# EAGLE design emonTx2.5 (EAGLE 6.5.0)
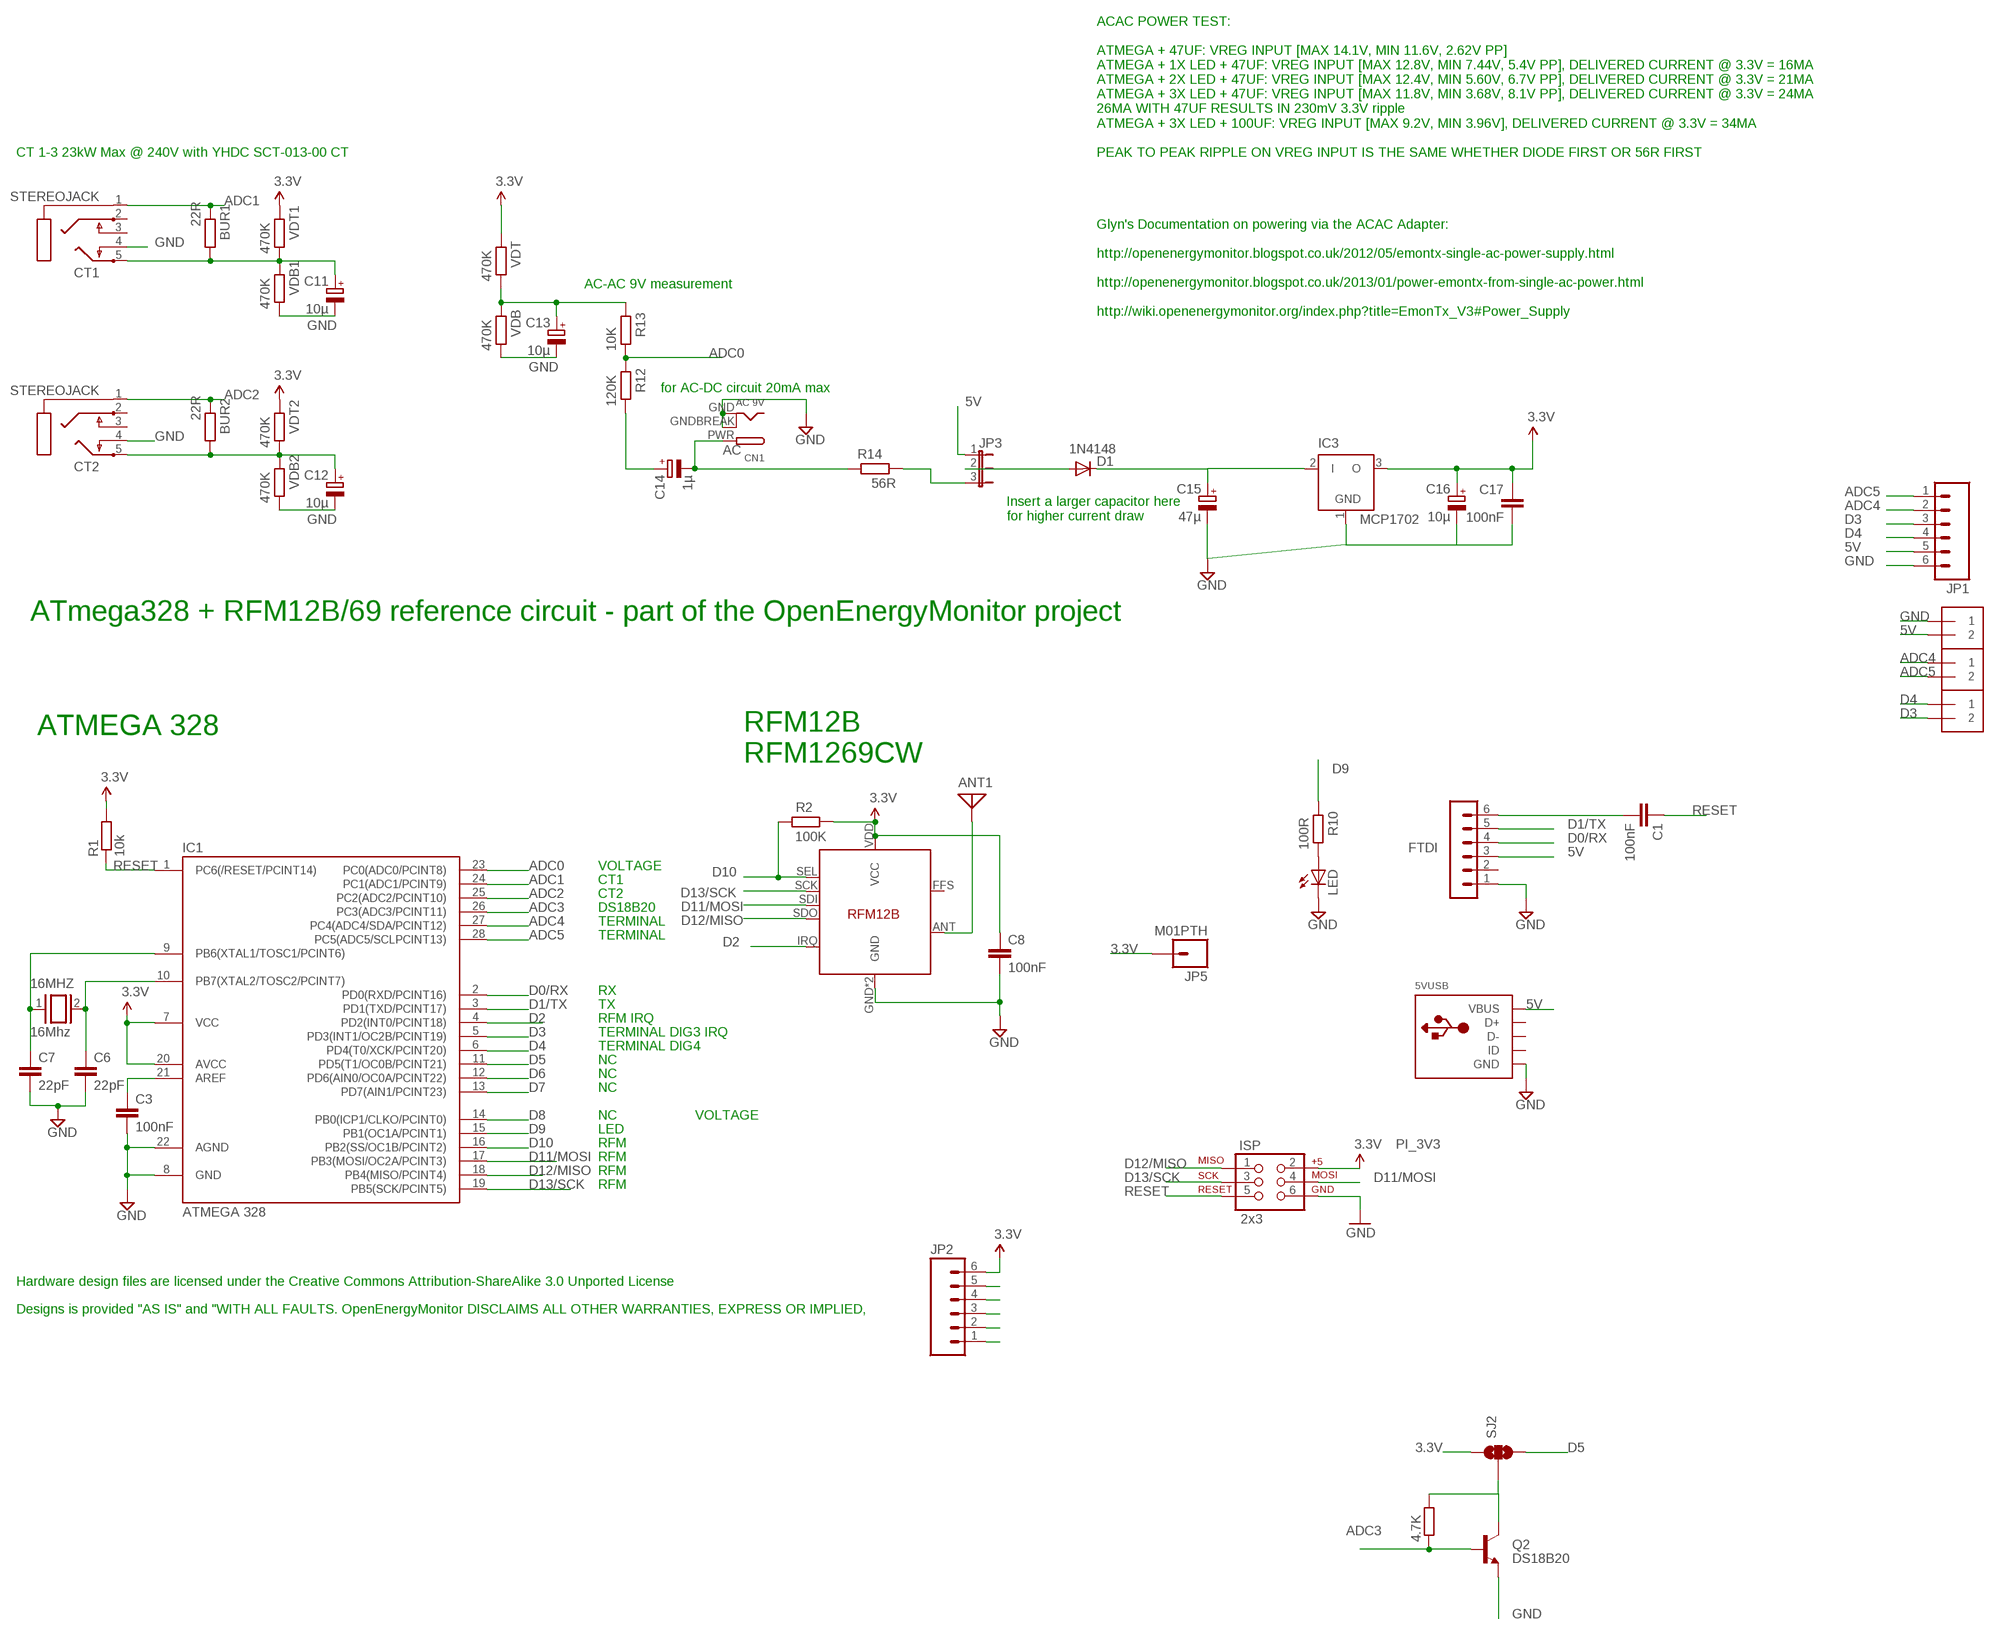
[diagram p0: schematic, sheet 1]

## Parts
5VUSB  USBMOLEX  [USB-MINIB-THM-MOLEX]
16MHZ  16Mhz  XTAL/S  [QS]
ANT1  ANTENNA  [PAD-01]
BUR1  22R  R-EU_0204/7  [0204/7]
BUR2  22R  R-EU_0204/7  [0204/7]
C1  100nF  C-EU025-024X044  [C025-024X044]
C3  100nF  C-EU025-024X044  [C025-024X044]
C6  22pF  C2.5/2  [C2.5-2]
C7  22pF  C2.5/2  [C2.5-2]
C8  100nF  C-EU025-024X044  [C025-024X044]
C11  10µ  CPOL-EUE1.8-4  [E1,8-4]
C12  10µ  CPOL-EUE1.8-4  [E1,8-4]
C13  10µ  CPOL-EUE1.8-4  [E1,8-4]
C14  1µ  CPOL-EUE1.8-4  [E1,8-4]
C15  47µ  CPOL-EUE1.8-4  [E1,8-4]
C16  10µ  CPOL-EUE1.8-4  [E1,8-4]
C17  100nF  C-EU025-024X044  [C025-024X044]
CN1  AC 9V  DCBARRELPTH  [DCJACK_2MM_PTH]
CT1  STEREOJACK  [STX3100]
CT2  STEREOJACK  [STX3100]
D1  1N4148  DIODE1N4148  [DIODE-1N4148]
FTDI  FTDI  MA06-1  [MA06-1]
IC1  ATMEGA 328  ATMEGA48/88/168-PU  [DIL28-3]
IC3  MCP1702  MCP1702Z  [TO92]
ISP  2x3  AVR_SPI_PRG_6PTH  [2X3]
J1  1X2-3.5MM  [1X2-3.5MM]
J2  1X2-3.5MM  [1X2-3.5MM]
J3  1X2-3.5MM  [1X2-3.5MM]
JP1  M06SIP  [1X06]
JP2  M06SIP  [1X06]
JP3  JP2E  [JP2]
JP5  M01PTH  [1X01]
LED  LED3MM  [LED3MM]
Q2  DS18B20  TRANSISTOR_NPNTO92  [TO-92]
R1  10k  R-EU_0204/7  [0204/7]
R2  100K  R-EU_0204/7  [0204/7]
R9  4.7K  R-EU_0204/7  [0204/7]
R10  100R  R-EU_0204/7  [0204/7]
R12  120K  R-EU_0204/7  [0204/7]
R13  10K  R-EU_0204/7  [0204/7]
R14  56R  R-EU_0204/7  [0204/7]
SJ2  SOLDERJUMPER_2WAY-OLDS  [SJ_3]
U$14  RFM12B  [RFM12B]
VDB  470K  R-EU_0204/7  [0204/7]
VDB1  470K  R-EU_0204/7  [0204/7]
VDB2  470K  R-EU_0204/7  [0204/7]
VDT  470K  R-EU_0204/7  [0204/7]
VDT1  470K  R-EU_0204/7  [0204/7]
VDT2  470K  R-EU_0204/7  [0204/7]

## Nets
3.3V: C8.1 C16.+ C17.1 IC1.7(VCC) IC1.20(AVCC) IC3.3(O) ISP.2 JP2.6 JP5.1 R1.2 R2.1 SJ2.1 U$14.VDD(VCC) VDT1.2 VDT2.2 VDT.2
5V [power]: 5VUSB.VBUS FTDI.3 J3.2 JP1.5 JP3.1
AC: C14.- CN1.PWR R14.2
ADC0: IC1.23(PC0(ADC0/PCINT8)) R12.2 R13.1
ADC1: BUR1.2 CT1.1 IC1.24(PC1(ADC1/PCINT9))
ADC2: BUR2.2 CT2.1 IC1.25(PC2(ADC2/PCINT10))
ADC3: IC1.26(PC3(ADC3/PCINT11)) Q2.2(B) R9.2
ADC4: IC1.27(PC4(ADC4/SDA/PCINT12)) J1.1 JP1.2
ADC5: IC1.28(PC5(ADC5/SCLPCINT13)) J1.2 JP1.1
D0/RX: FTDI.4 IC1.2(PD0(RXD/PCINT16))
D1/TX: FTDI.5 IC1.3(PD1(TXD/PCINT17))
D2: IC1.4(PD2(INT0/PCINT18)) U$14.IRQ
D3: IC1.5(PD3(INT1/OC2B/PCINT19)) J2.2 JP1.3
D4: IC1.6(PD4(T0/XCK/PCINT20)) J2.1 JP1.4
D5: IC1.11(PD5(T1/OC0B/PCINT21)) JP2.2 SJ2.3
D6: IC1.12(PD6(AIN0/OC0A/PCINT22)) JP2.3
D7: IC1.13(PD7(AIN1/PCINT23)) JP2.4
D8: IC1.14(PB0(ICP1/CLKO/PCINT0)) JP2.5
D9: IC1.15(PB1(OC1A/PCINT1)) R10.2
D10: IC1.16(PB2(SS/OC1B/PCINT2)) R2.2 U$14.SEL
D11/MOSI: IC1.17(PB3(MOSI/OC2A/PCINT3)) ISP.4 U$14.SDI
D12/MISO: IC1.18(PB4(MISO/PCINT4)) ISP.1 U$14.SDO
D13/SCK: IC1.19(PB5(SCK/PCINT5)) ISP.3 U$14.SCK
DIG1: ANT1.1 U$14.ANT
GND [power]: 5VUSB.GND C3.2 C6.2 C7.2 C8.2 C11.- C12.- C13.- C15.- C16.- C17.2 CN1.GND CN1.GNDBREAK CT1.4 CT2.4 FTDI.1 IC1.8(GND) IC1.22(AGND) IC3.1(GND) ISP.6 J3.1 JP1.6 JP2.1 LED.K(C) Q2.1(E) U$14.GND U$14.P$12(GND) VDB1.1 VDB2.1 VDB.1
N$1: 16MHZ.2 C6.1 IC1.10(PB7(XTAL2/TOSC2/PCINT7))
N$2: BUR2.1 C12.+ CT2.5 VDB2.2 VDT2.1
N$3: JP3.3 R14.1
N$4: C15.+ D1.C IC3.2(I)
N$5: D1.A JP3.2
N$7: C14.+ R12.1
N$8: LED.A R10.1
N$9: Q2.3(C) R9.1 SJ2.2
N$12: 16MHZ.1 C7.1 IC1.9(PB6(XTAL1/TOSC1/PCINT6))
N$15: C1.2 FTDI.6
N$19: C3.1 IC1.21(AREF)
N$34: C13.+ R13.2 VDB.2 VDT.1
N$38: BUR1.1 C11.+ CT1.5 VDB1.2 VDT1.1
RESET: C1.1 IC1.1(PC6(/RESET/PCINT14)) ISP.5 R1.1
Unconnected: 5VUSB.D+ 5VUSB.D- 5VUSB.ID CT1.2 CT1.3 CT2.2 CT2.3 FTDI.2 U$14.FFS

## Notes on the sheet
- CT 1-3 23kW Max @ 240V with YHDC SCT-013-00 CT
- ACAC POWER TEST:
  
  ATMEGA + 47UF: VREG INPUT [MAX 14.1V, MIN 11.6V, 2.62V PP]
  ATMEGA + 1X LED + 47UF: VREG INPUT [MAX 12.8V, MIN 7.44V, 5.4V PP], DELIVERED CURRENT @ 3.3V = 16MA
  ATMEGA + 2X LED + 47UF: VREG INPUT [MAX 12.4V, MIN 5.60V, 6.7V PP], DELIVERED CURRENT @ 3.3V = 21MA
  ATMEGA + 3X LED + 47UF: VREG INPUT [MAX 11.8V, MIN 3.68V, 8.1V PP], DELIVERED CURRENT @ 3.3V = 24MA
  26MA WITH 47UF RESULTS IN 230mV 3.3V ripple
  ATMEGA + 3X LED + 100UF: VREG INPUT [MAX 9.2V, MIN 3.96V], DELIVERED CURRENT @ 3.3V = 34MA
  
  PEAK TO PEAK RIPPLE ON VREG INPUT IS THE SAME WHETHER DIODE FIRST OR 56R FIRST
- AC-AC 9V measurement
- Glyn's Documentation on powering via the ACAC Adapter:
  
  http://openenergymonitor.blogspot.co.uk/2012/05/emontx-single-ac-power-supply.html
  
  http://openenergymonitor.blogspot.co.uk/2013/01/power-emontx-from-single-ac-power.html
  
  http://wiki.openenergymonitor.org/index.php?title=EmonTx_V3#Power_Supply
- for AC-DC circuit 20mA max
- Insert a larger capacitor here
  for higher current draw
- ATmega328 + RFM12B/69 reference circuit - part of the OpenEnergyMonitor project
- ATMEGA 328
- RFM12B
  RFM1269CW
- VOLTAGE
- CT1
- CT2
- DS18B20
- TERMINAL
- TERMINAL
- RX
- TX
- RFM IRQ
- TERMINAL DIG3 IRQ
- TERMINAL DIG4
- NC
- NC
- NC
- NC | VOLTAGE
- LED
- RFM
- RFM
- RFM
- RFM
- Hardware design files are licensed under the Creative Commons Attribution-ShareAlike 3.0 Unported License
- Designs is provided "AS IS" and "WITH ALL FAULTS. OpenEnergyMonitor DISCLAIMS ALL OTHER WARRANTIES, EXPRESS OR IMPLIED,

## Library data of the parts
5VUSB = adafruit:USB: USB Connectors USBMINIB - Surface Mount Female Mini-B USB Connector 4UConnector: 06564 By microbuilder.eu Thru-hole RA Female Mini-B USB Connector 4UConnector: 18732 By ladyada.net
16MHZ = special:XTAL/S: CRYSTAL
ANT1 = discrete:ANTENNA: Antenna
BUR1 BUR2 R2 R9 R10 R12-R14 VDB VDB1 VDB2 VDT VDT1 VDT2 = rcl:R-EU_: RESISTOR, European symbol
C1 C3 C8 C17 = resistor:C-EU: CAPACITOR, European symbol
C6 C7 = capacitor-wima:C: CAPACITOR naming: grid - package width
C11-C16 = resistor:CPOL-EU: POLARIZED CAPACITOR, European symbol
CN1 = adafruit:DCBARREL: 2.0mm DC Barrel Jack DCJACK_2MM_PTH - Through Hole Jack (4UConnector: 05537)
CT1 CT2 = adafruit:STEREOJACK: MIC/HEADPHONE JACK Stereo jack with two switches. Kycon STX3100, CUI SJ1-3555NG and/or 4UCon 05544
D1 = SparkFun:DIODE: Diode These are standard reverse protection diodes and small signal diodes. SMA package can handle up to about 1A. SOD-323 can handle about 200mA. What the SOD-323 package when ordering, there are some mfgs out there that are 5-pin packages.
FTDI = JeeLabs:MA06-1: PIN HEADER
IC1 = atmega8:ATMEGA48/88/168-PU
IC3 = JeeLabs:MCP1702: 200 mA, Low Power Low Dropout Voltage Regulator
ISP = SparkFun:AVR_SPI_PRG_6: AVR ISP 6 Pin This is the reduced ISP connector for AVR programming. Common on Arduino. This footprint will take up less PCB space and can be used with a 10-pin to 6-pin adapter such as SKU: BOB-08508
J1-J3 = adafruit:1X2: 3.5mm Terminal block http://www.ladyada.net/library/pcb/eaglelibrary.html
JP1 JP2 = SparkFun:M06: Header 6 Standard 6-pin 0.1" header. Use with straight break away headers (SKU : PRT-00116), right angle break away headers (PRT-00553), swiss pins (PRT-00743), machine pins (PRT-00117), and female headers (PRT-00115). Molex polarized connector foot print use with SKU : PRT-08094 with associated crimp pins and housings. NOTES ON THE VARIANTS LOCK and LOCK_LONGPADS... This footprint was designed to help hold the alignment of a through-hole component (i.e. 6-pin header) while soldering it into place. You may notice that each hole has been shifted either up or down by 0.005 of an inch from it's more standard position (which is a perfectly straight line). This slight alteration caused the pins (the squares in the middle) to touch the edges of the holes. Because they are alternating, it causes a "brace" to hold the component in place. 0.005 has proven to be the perfect amount of "off-center" position when using our standard breakaway headers. Although looks a little odd when you look at the bare footprint, once you have a header in there, the alteration is very hard to notice. Also, if you push a header all the way into place, it is covered up entirely on the bottom side. This idea of altering the position of holes to aid alignment will be further integrated into the Sparkfun Library for other footprints. It can help hold any component with 3 or more connection pins.
JP3 = jumper:JP2E: JUMPER
JP5 = SparkFun:M01: Header 1 Standard 1-pin 0.1" header. Use with straight break away headers (SKU : PRT-00116), right angle break away headers (PRT-00553), swiss pins (PRT-00743), machine pins (PRT-00117), and female headers (PRT-00115).
LED = adafruit:LED: LED OSRAM: - CHIPLED LG R971, LG N971, LY N971, LG Q971, LY Q971, LO R971, LY R971 LH N974, LH R974 LS Q976, LO Q976, LY Q976 LO Q996 - Hyper CHIPLED LW Q18S LB Q993, LB Q99A, LB R99A - SideLED LS A670, LO A670, LY A670, LG A670, LP A670 LB A673, LV A673, LT A673, LW A673 LH A674 LY A675 LS A676, LA A676, LO A676, LY A676, LW A676 LS A679, LY A679, LG A679 - Hyper Micro SIDELED® LS Y876, LA Y876, LO Y876, LY Y876 LT Y87S - SmartLED LW L88C, LW L88S LB L89C, LB L89S, LG L890 LS L89K, LO L89K, LY L89K LS L896, LA L896, LO L896, LY L896 - TOPLED LS T670, LO T670, LY T670, LG T670, LP T670 LSG T670, LSP T670, LSY T670, LOP T670, LYG T670 LG T671, LOG T671, LSG T671 LB T673, LV T673, LT T673, LW T673 LH T674 LS T676, LA T676, LO T676, LY T676, LB T676, LH T676, LSB T676, LW T676 LB T67C, LV T67C, LT T67C, LS T67K, LO T67K, LY T67K, LW E67C LS E67B, LA E67B, LO E67B, LY E67B, LB E67C, LV E67C, LT E67C LW T67C LS T679, LY T679, LG T679 LS T770, LO T770, LY T770, LG T770, LP T770 LB T773, LV T773, LT T773, LW T773 LH T774 LS E675, LA E675, LY E675, LS T675 LS T776, LA T776, LO T776, LY T776, LB T776 LHGB T686 LT T68C, LB T68C - Hyper Mini TOPLED® LB M676 - Mini TOPLED Santana® LG M470 LS M47K, LO M47K, LY M47K Source: http://www.osram.convergy.de/
Q2 = SparkFun:TRANSISTOR_NPN: Transistor NPN BJT configuration in SOT23 package. MMBT2222 is the common NPN we use. Double check BCE configuration again layout.
R1 = resistor:R-EU_: RESISTOR, European symbol
SJ2 = SparkFun:SOLDERJUMPER_2WAY-OLD: Solder Jumper 2 way solder jumper
U$14 = JeeParts:RFM12B

## Net classes
0 default: width 0.203 mm, drill 0.6 mm, clearance 0.203 mm
1 power: width 0.381 mm, drill 0.6 mm, clearance 0.254 mm
2 gnd: width 0.254 mm, drill 0.6 mm, clearance 0.254 mm

## Board
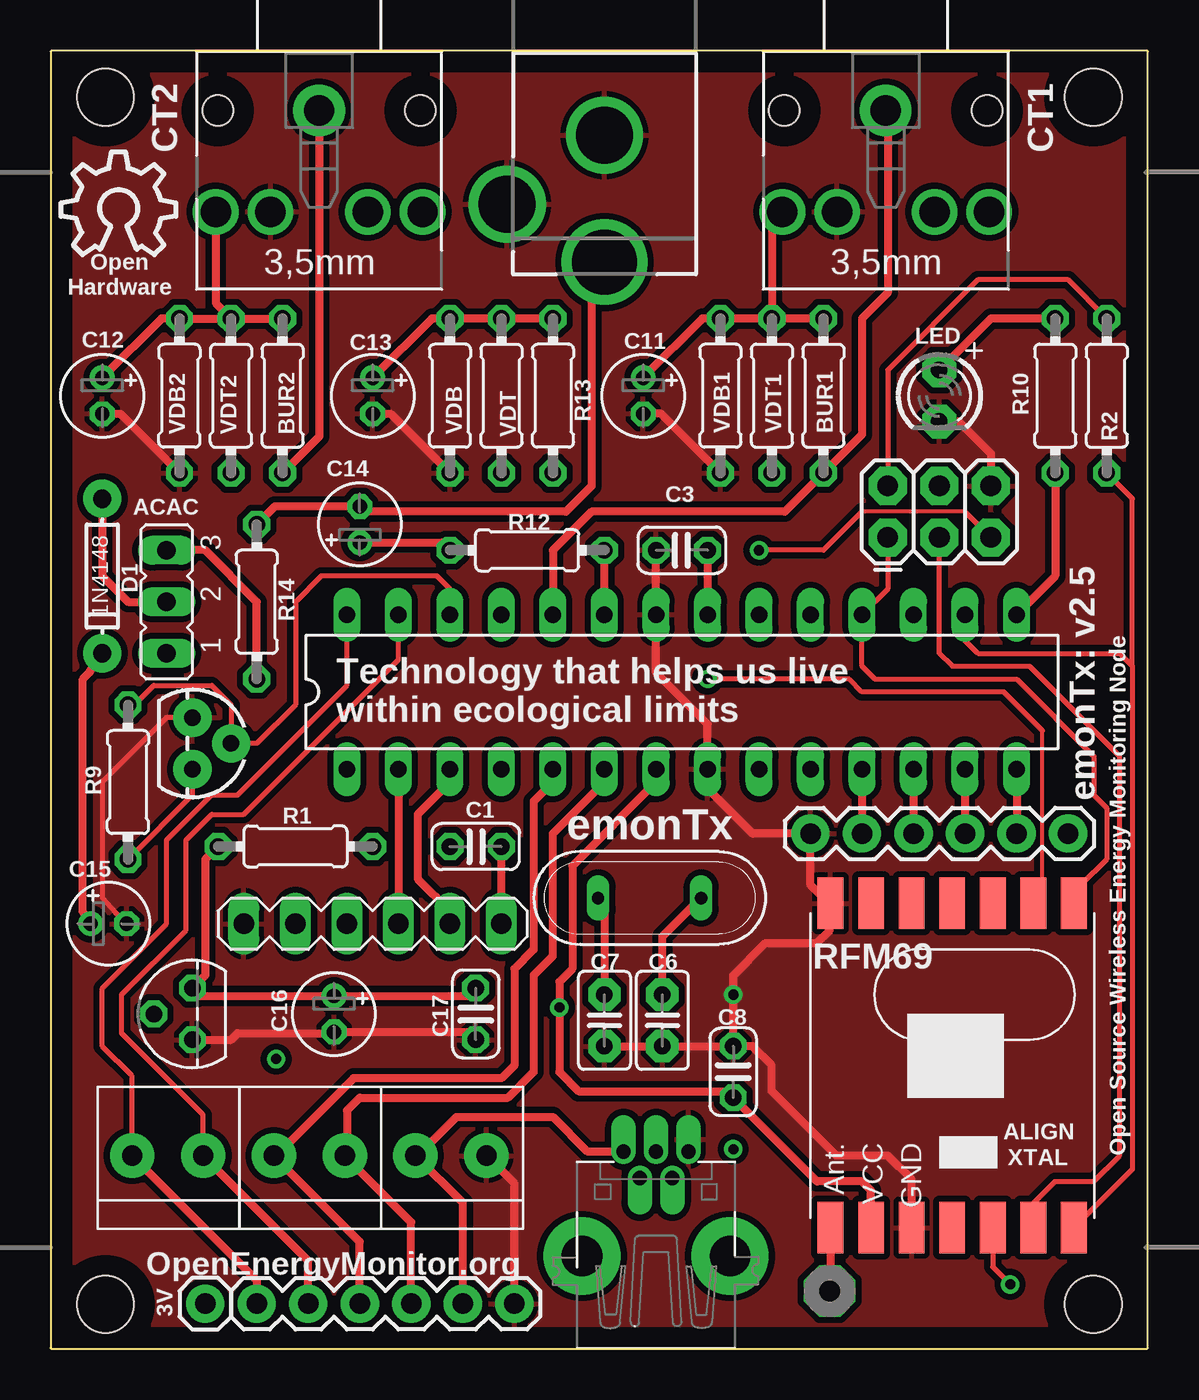
[diagram p1: board, top side]
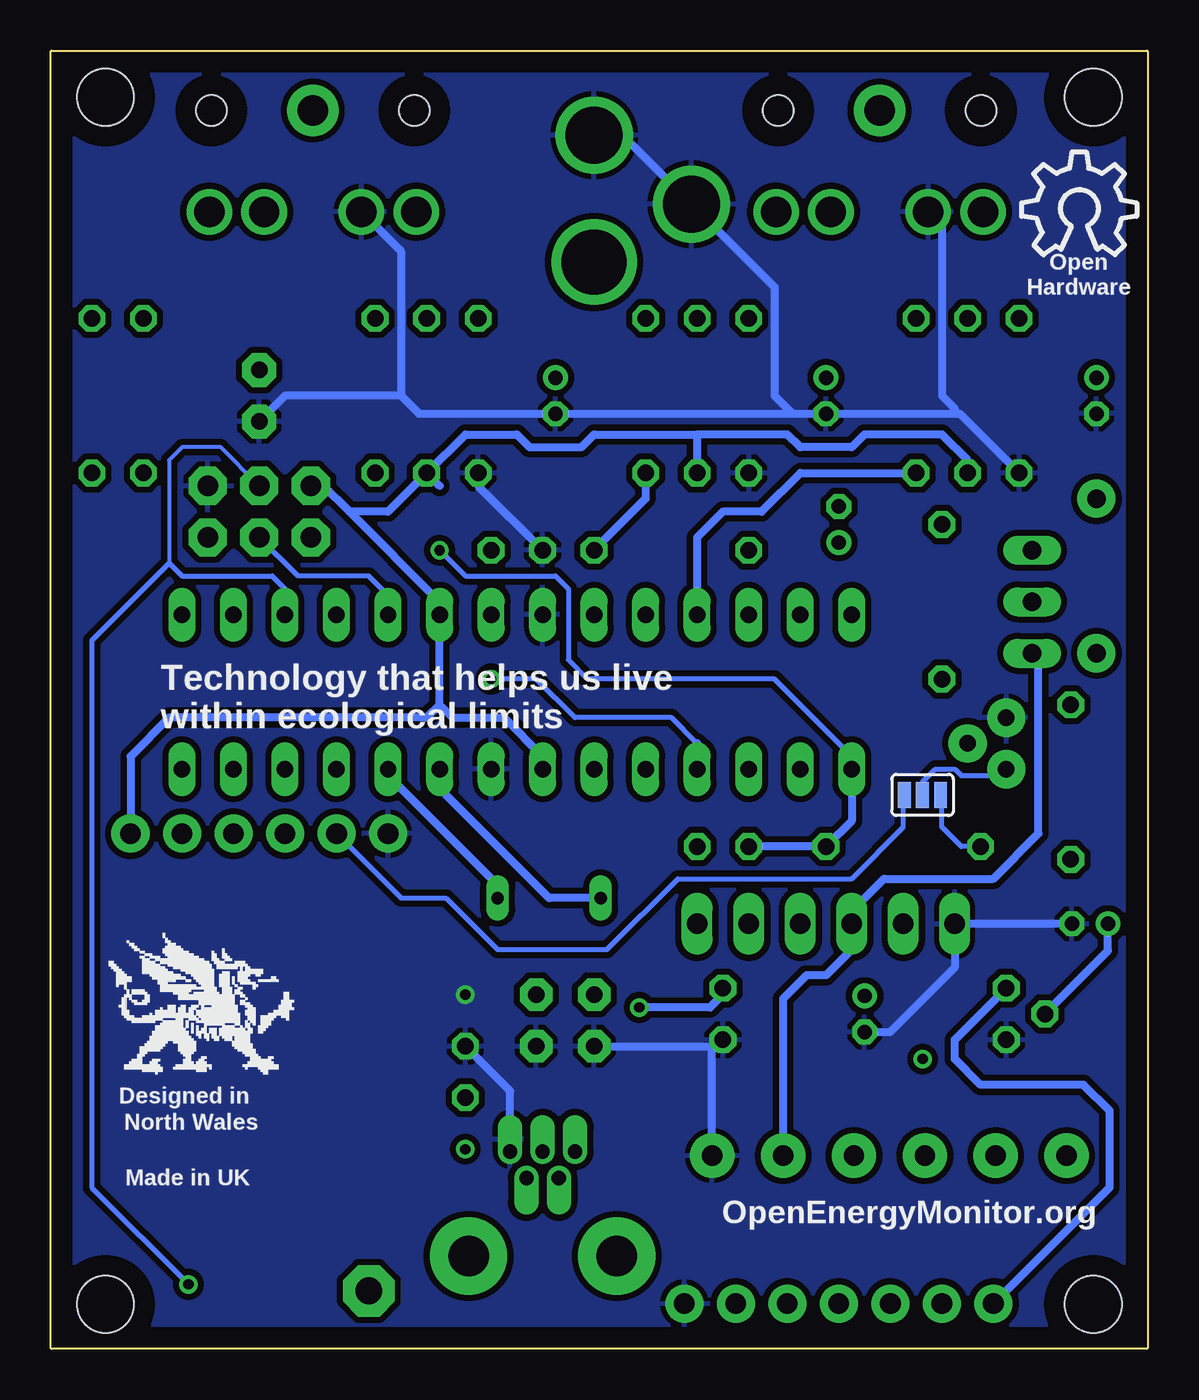
[diagram p2: board, bottom side, seen from below]

Size 54.1 x 64 mm. Coordinates in mm from the lower left corner, seen from the top.
Outline: 54.05,64 0.05,64
Outline: 0,63.95 0,0.05
Outline: 0.05,0 54.05,0
Outline: 54.1,0.05 54.1,63.95
Copper layers (1*16): Top 0.035mm / dielectric 1.5mm / Bottom 0.035mm
Design rules "default *": minimum track width 10mil, minimum drill 24mil, track to track 8mil, track to pad 8mil, pad to pad 8mil, via to via 8mil, smd to smd 8mil, copper to edge 40mil, drill to drill 8mil, minimum pad ring 10mil, minimum via ring 8mil, stop-mask expansion 4mil, vias tented up to drill 0.6mm, thermal gap 10mil
Holes 2.8 mm at 2.7,2.2 2.7,61.7 51.4,61.7 51.4,2.2

### Footprints (pad centres in the part's own frame; a part is rotated, then mirrored left to right if it is on the bottom)
USB-MINIB-THM-MOLEX = drill 0.7 offset: D+ 0,9.72; D- -0.8,8.42; GND 1.6,9.72; ID 0.8,8.42; VBUS -1.6,9.72 | drill 2 pad 3.81: GND1 -3.65,4.57; GND4 3.65,4.57
QS = drill 0.61 long: 1 -2.54,0; 2 2.54,0
PAD-01 = drill 1.321 pad 2.54 octagon: 1 0,0
0204/7 = drill 0.813 octagon: 1 -3.81,0; 2 3.81,0
C025-024X044 = drill 0.813 octagon: 1 -1.27,0; 2 1.27,0
C2.5-2 = drill 0.813 pad 1.6 octagon: 1 -1.27,0; 2 1.27,0
E1,8-4 = drill 0.711 pad 1.168: + -0.889,0 | drill 0.711 pad 1.168 octagon: - 0.889,0
DCJACK_2MM_PTH = drill 2.8: GND 0,7.35; GNDBREAK 4.8,10.75 | drill 3.2: PWR 0,13.6
STX3100 = drill 1.5 pad 2.54: 1 2.7,-0.1 | drill 1.5: 2 7.7,5; 3 7.7,2.3; 4 7.7,-2.5; 5 7.7,-5.2 | hole 1.5: 2.7,4.9; 2.7,-5.1
DIODE-1N4148 = drill 0.9 pad 1.88: A -3.81,0; C 3.81,0
MA06-1 = drill 1.016 long: 1 0,0; 2 2.54,0; 3 5.08,0; 4 7.62,0; 5 10.16,0; 6 12.7,0
DIL28-3 = drill 0.813 long: 1 -16.51,-3.81; 2 -13.97,-3.81; 3 -11.43,-3.81; 4 -8.89,-3.81; 5 -6.35,-3.81; 6 -3.81,-3.81; 7 -1.27,-3.81; 8 1.27,-3.81; 9 3.81,-3.81; 10 6.35,-3.81; 11 8.89,-3.81; 12 11.43,-3.81; 13 13.97,-3.81; 14 16.51,-3.81; 15 16.51,3.81; 16 13.97,3.81; 17 11.43,3.81; 18 8.89,3.81; 19 6.35,3.81; 20 3.81,3.81; 21 1.27,3.81; 22 -1.27,3.81; 23 -3.81,3.81; 24 -6.35,3.81; 25 -8.89,3.81; 26 -11.43,3.81; 27 -13.97,3.81; 28 -16.51,3.81
TO92 = drill 0.813 octagon: 1 -1.27,0; 2 0,1.905; 3 1.27,0
2X3 = drill 1.016 pad 1.88 octagon: 1 0,0; 2 0,2.54; 3 2.54,0; 4 2.54,2.54; 5 5.08,0; 6 5.08,2.54
1X2-3.5MM = drill 1 pad 2.184: 1 1.8,0; 2 -1.7,0
1X06 = drill 1.016 pad 1.88: 1 0,0; 2 2.54,0; 3 5.08,0; 4 7.62,0; 5 10.16,0; 6 12.7,0
JP2 = drill 0.914 long: 1 -2.54,0; 2 0,0; 3 2.54,0
1X01 = drill 1.016 pad 1.88: 1 0,0
LED3MM = drill 0.813 pad 1.676 octagon: A -1.27,0; K 1.27,0
TO-92 = drill 0.813 pad 1.88: 1 -1.27,0; 2 0,1.905; 3 1.27,0
SJ_3 = smd 0.635 x 1.27: 1 -0.889,0; 2 0,0; 3 0.889,0
RFM12B = smd 2.54 x 1.27: ANT 8,-6; FFS -8,2; GND 8,-2; IRQ -8,4; P$8 -8,0; P$9 -8,-2; P$10 -8,-4; P$12 -8,-6; P$16 8,0; SCK 8,4; SDI 8,2; SDO -8,6; SEL 8,6; VDD 8,-4

### Placement (x,y rotation side)
5VUSB  29.84,0 0 top
16MHZ  29.53,22.22 0 top
ANT1  38.42,2.86 0 top
BUR1  38.1,46.99 270 top
BUR2  11.43,46.99 270 top
C1  20.96,24.77 0 top
C3  31.12,39.37 180 top
C6  30.16,16.19 270 top
C7  27.3,16.19 270 top
C8  33.66,13.65 90 top
C11  29.21,46.99 270 top
C12  2.54,46.99 270 top
C13  15.88,46.99 270 top
C14  15.24,40.64 90 top
C15  2.86,20.95 0 top
C16  13.97,16.51 270 top
C17  20.96,16.51 270 top
CN1  27.3,67.18 180 top
CT1  41.27,63.75 270 top
CT2  13.34,63.75 270 top
D1  2.54,38.1 270 top
FTDI  9.53,20.95 0 top
IC1  31.12,32.38 0 top
IC3  6.99,16.51 90 top
ISP  41.27,40 0 top
J1  5.71,9.53 0 top
J2  12.7,9.53 0 top
J3  19.69,9.53 0 top
JP1  10.16,2.22 0 top
JP2  37.47,25.4 0 top
JP3  5.71,36.83 90 top
JP5  7.62,2.22 0 top
LED  43.81,46.99 270 top
LOGO1  OSHW_LOGO_10MILX0200-NT  [OSHW_10X200_NOTEXT]  0.51,53.93 0 top
LOGO2  OSHW_LOGO_10MILX0200-NT  [OSHW_10X200_NOTEXT]  6.22,53.93 0 bottom
Q2  6.99,29.84 270 top
R1  12.07,24.77 180 top
R2  52.07,46.99 270 top
R9  3.81,27.94 90 top
R10  49.53,46.99 270 top
R12  23.5,39.37 0 top
R13  24.77,46.99 90 top
R14  10.16,36.83 90 top
SJ2  11.11,27.3 180 bottom
U$14  44.45,13.97 270 top
VDB  19.69,46.99 90 top
VDB1  33.02,46.99 90 top
VDB2  6.35,46.99 90 top
VDT  22.23,46.99 270 top
VDT1  35.56,46.99 270 top
VDT2  8.89,46.99 270 top

### Tracks (layer width: path | path; a pad name or v marks a point on that pad's centre or on a via)
3.3V  (via drill 0.5)
  Top 0.254: R2.1 50.16,52.7 45.72,52.7 41.27,48.26 ISP.2
  Top 0.406: C17.1 arc-90 20.57,17.4 C16.+ 7.37,17.4 IC3.3 7.62,18.41 7.62,24.13 R1.2 | U$14.VDD 40.45,7.81 40.01,8.26 37.78,8.26 C8.1 33.66,12.7 26.04,12.7 25.08,13.65 v25.08,16.83 25.08,18.1 25.72,18.73 25.72,23.81 29.84,27.94 IC1.7
  Bottom 0.203: 10.16,27.24 SJ2.1
  Bottom 0.254: R1.2 9.21,24.77 10.16,25.72 10.16,27.24
  Bottom 0.406: 34.92,31.75 IC1.20 34.92,36.83 39.37,41.27 | VDT2.2 8.89,43.81 10.16,45.09 13.97,45.09 14.61,44.45 17.14,44.45 17.78,45.09 22.23,45.09 | 22.23,45.09 VDT.2 | VDT1.2 33.66,45.09 31.12,45.09 30.48,44.45 27.94,44.45 27.3,45.09 22.23,45.09 | 34.92,42.55 VDT1.2 | VDT1.2 37.47,41.27 39.37,41.27 | 34.92,31.75 34.29,31.12 31.75,31.12 29.84,29.21 IC1.7 | 34.92,31.75 35.56,31.12 48.26,31.12 50.16,29.21 JP2.6 | C17.1 20.96,17.46 21.59,16.83 v25.08,16.83 | 39.37,41.27 40.64,42.55 ISP.2 | IC3.3 9.53,15.24 9.53,14.29 8.25,13.02 3.17,13.02 1.91,11.75 1.91,7.94 JP5.1
5V
  Top 0.406: 5VUSB.VBUS 26.48,9.72 24.77,11.43 20,11.43 18.1,9.53 J3.2 20.32,7.19 JP1.5
  Bottom 0.406: J3.2 17.98,17.26 16.83,18.41 15.88,18.41 14.61,19.68 FTDI.3 14.61,21.59 13.02,23.18 7.62,23.18 5.4,25.4 5.4,33.97 JP3.1
AC
  Top 0.406: CN1.PWR 26.67,52.95 26.67,42.55 25.4,41.27 15.49,41.27 C14.- 11.05,41.53 R14.2
ADC0
  Top 0.406: IC1.23 R12.2
  Bottom 0.406: R13.1 24.77,41.91 R12.2
ADC1
  Top 0.406: CT1.1 41.27,60.95 41.27,52.07 40.01,50.8 40.01,45.09 BUR1.2 36.2,41.27 26.67,41.27 24.77,39.37 IC1.24
ADC2
  Top 0.406: CT2.1 13.23,44.98 BUR2.2
  Bottom 0.406: BUR2.2 17.14,43.18 19.05,41.27 20.96,41.27 22.23,40 IC1.25
ADC3
  Top 0.203: R9.2 4.13,31.75
  Top 0.254: IC1.26 19.69,37.46 19.05,38.1 13.34,38.1 12.07,36.83 12.07,31.75 10.16,29.84 Q2.2 8.89,31.75 7.94,32.7 5.08,32.7 4.13,31.75
ADC4
  Top 0.203: 17.14,35.56 IC1.27
  Top 0.254: J1.1 7.51,11.54 3.49,15.56 3.49,17.46 6.67,20.64 6.67,25.08 7.94,26.35 9.53,26.35 17.14,33.97 17.14,35.56
  Top 0.406: JP1.2 12.7,4.34 J1.1
ADC5
  Top 0.254: J1.2 4.01,13.45 2.54,14.92 2.54,17.78 5.71,20.95 5.71,25.08 7.94,27.3 9.21,27.3 14.61,32.7 IC1.28
  Top 0.406: JP1.1 10.16,3.38 J1.2
D0/RX
  Top 0.406: IC1.2 FTDI.4
D1/TX
  Top 0.406: IC1.3 19.69,27.94 18.1,26.35 18.1,23.18 19.69,21.59 FTDI.5
D2  (via drill 0.5)
  Top 0.203: U$14.IRQ 48.9,22.41 48.9,30.48
  Top 0.254: 48.9,30.48 46.99,32.38 40.01,32.38 39.37,33.02 v32.38,33.02
  Bottom 0.254: 22.23,29.84 23.5,31.12 28.26,31.12 30.16,33.02 v32.38,33.02
  Bottom 0.406: IC1.4 22.23,29.84
D3
  Top 0.406: IC1.5 24.77,27.94 23.81,26.99 23.81,19.68 22.86,18.73 22.86,13.97 22.23,13.34 14.92,13.34 11.11,9.53 J2.2 15.24,5.29 JP1.3
D4
  Top 0.406: IC1.6 27.3,27.94 24.77,25.4 24.77,19.37 23.81,18.41 23.81,13.65 22.54,12.38 15.24,12.38 14.61,11.75 14.61,9.63 J2.1 17.78,6.25 JP1.4
D5
  Top 0.406: IC1.11 JP2.2
  Bottom 0.203: 12.07,27.24 SJ2.3
  Bottom 0.254: JP2.2 36.83,22.22 34.61,22.22 32.07,19.68 26.67,19.68 23.18,23.18 14.61,23.18 12.07,25.72 12.07,27.24
D6
  Top 0.406: IC1.12 JP2.3
D7
  Top 0.406: IC1.13 JP2.4
D8
  Top 0.406: IC1.14 JP2.5
D9
  Top 0.406: R10.2 49.53,38.1 IC1.15
D10
  Top 0.203: 45.09,34.92 IC1.16
  Top 0.254: 53.34,33.66 53.34,41.91 R2.2 | 53.34,33.66 52.7,34.29 45.72,34.29 45.09,34.92 | 53.34,33.66 53.34,8.86 U$14.SEL
D11/MOSI  (via drill 0.5)
  Top 0.254: U$14.SDI 46.45,4.03 v47.31,3.17
  Bottom 0.203: ISP.4 45.72,44.45 47.62,44.45 48.26,43.81 48.26,38.73
  Bottom 0.254: IC1.17 42.55,37.46 43.18,38.1 47.62,38.1 48.26,38.73 52.07,34.92 52.07,7.94 v47.31,3.17
D12/MISO
  Top 0.254: ISP.1 41.27,37.46 IC1.18 40.01,33.66 40.64,33.02 47.62,33.02 51.44,29.21 51.44,27.3 52.07,26.67 52.07,24.13 50.8,22.86 50.8,22.32 U$14.SDO
D13/SCK
  Top 0.203: 48.26,6.99 48.26,6.16 U$14.SCK
  Top 0.254: ISP.3 43.81,34.29 44.45,33.66 48.26,33.66 52.7,29.21 52.7,9.53 51.44,8.26 49.53,8.26 48.26,6.99
  Bottom 0.203: IC1.19 37.47,37.15
  Bottom 0.254: 37.47,37.15 38.42,38.1 41.91,38.1 ISP.3
DIG1
  Top 0.406: U$14.ANT 38.45,2.83 ANT1.1
GND  (via drill 0.5)
  Top 0.254: C15.- 3.17,21.53 2.54,22.22 2.54,27.94 5.71,31.12 Q2.1
  Top 0.406: C17.2 20.57,15.62 C16.- 13.91,15.56 9.21,15.56 8.89,15.24 IC3.1 | C12.- 3.43,46.1 VDB2.1 | C13.- 16.76,46.1 VDB.1 | VDB1.1 30.1,46.1 C11.- | C3.2 IC1.22 29.84,33.34 32.38,30.8 IC1.8 32.38,27.62 34.61,25.4 JP2.1 37.47,22.86 38.1,22.22 | U$14.GND 42.45,8.35 41.27,9.53 38.73,9.53 35.56,12.7 35.56,13.97 34.61,14.92 C8.2 | C7.2 C6.2 C8.2 | LED.K 44.77,45.72 46.36,44.13 ISP.6 | JP1.6 22.86,8.15 J3.1 | C8.2 v33.66,17.46 33.66,18.41 35.24,20 37.78,20 38.42,20.64 38.42,21.94 U$14.P$12
  Bottom 0.406: 9.53,46.1 C13.- 17.53,46.1 | 9.53,46.1 9.27,46.1 VDB2.1 | 17.53,46.1 C11.- 35.94,46.1 36.83,46.99 | CT2.4 10.16,55.38 10.16,46.99 9.53,46.35 9.53,46.1 | CT1.4 36.83,54.11 36.83,46.99 | 17.53,46.1 18.41,46.99 18.41,52.34 CN1.GNDBREAK 25.91,59.83 CN1.GND | C15.- FTDI.1 9.53,18.8 12.7,15.62 C16.- | 36.83,46.99 42.55,46.99 LED.K | VDB1.1 33.02,42.55 C3.2 | 37.47,24.77 JP2.1 | 5VUSB.GND 31.45,12.71 C8.2 | C7.2 21.27,14.92 C17.2 21.48,14.71 J3.1
  pour Top (isolate 0.305): 0,64.14 0,0 53.98,0 53.98,64.14
  pour Bottom (isolate 0.305): -0.32,64.45 -0.32,-0.32 54.29,-0.32 54.29,0 54.29,64.45
N$1
  Top 0.406: 32.07,22.86 16MHZ.2 30.16,20.32 C6.1
  Bottom 0.406: IC1.10 37.47,28.26 32.07,22.86 16MHZ.2
N$2
  Top 0.406: VDT2.1 VDB2.2 5.46,50.8 C12.+ | VDT2.1 BUR2.1 | CT2.5 8.13,51.55 VDT2.1
N$3
  Top 0.406: R14.1 10.16,36.83 7.62,39.37 JP3.3
N$4
  Top 0.406: C15.+ 1.91,21.21 1.59,21.53 1.59,33.02 1.91,33.34 D1.C
  Bottom 0.406: IC3.2 1.97,19.62 C15.+
N$5
  Top 0.406: D1.A 2.54,38.1 3.81,36.83 JP3.2
N$6  (via drill 0.5)
  other vias: 11.11,14.29
N$7
  Top 0.406: C14.+ 19.3,39.75 R12.1
N$8
  Top 0.406: R10.1 46.36,50.8 LED.A
N$9
  Top 0.254: Q2.3 6.99,27.3 R9.1
  Bottom 0.203: SJ2.2 11.11,27.94
  Bottom 0.254: 11.11,27.94 10.48,28.57 9.53,28.57 9.21,28.26 7.3,28.26 Q2.3
N$10  (via drill 0.5)
  other vias: 33.66,9.84
N$12
  Top 0.406: 16MHZ.1 27.3,21.91 C7.1
  Bottom 0.406: 16MHZ.1 29.53,22.22 34.92,27.62 IC1.9
N$15
  Top 0.406: FTDI.6 C1.2
N$19
  Top 0.406: C3.1 IC1.21
N$34
  Top 0.406: R13.2 VDT.1 VDB.2 18.8,50.8 C13.+
N$38
  Top 0.406: BUR1.1 VDT1.1 | VDT1.1 VDB1.2 32.13,50.8 C11.+ | CT1.5 35.56,55.54 VDT1.1
RESET  (via drill 0.5)
  Top 0.203: 45.09,41.27 40.01,41.27
  Top 0.254: ISP.5 45.09,41.27 | 40.01,41.27 38.1,39.37 v34.92,39.37
  Bottom 0.203: 14.61,29.21 IC1.1
  Bottom 0.254: v34.92,39.37 33.66,38.1 29.21,38.1 28.58,37.46 28.58,33.97 27.62,33.02 18.41,33.02 14.61,29.21
  Bottom 0.406: IC1.1 14.61,26.04 R1.1 C1.1

### Text on the board
tPlace: Open / Hardware
bPlace: Open / Hardware | Technology that helps us live / within ecological limits | Designed in | North Wales | Made in UK
tValues: GND D5 D6 D7 D8 3V | A5 | A4 | D3 | D4 | 5V | GND
tDocu: REAR GRILL 35mm | FRONT GRILL 35mm
tSilk: ACAC | Technology that helps us live / within ecological limits | emonTx: v2.5 | emonTx | RFM69 | ALIGN | XTAL | OpenEnergyMonitor.org | 3V
_tsilk: Open Source Wireless Energy Monitoring Node
_bsilk: OpenEnergyMonitor.org